# EAGLE schematic vulcan1 (EAGLE 7.1.0)
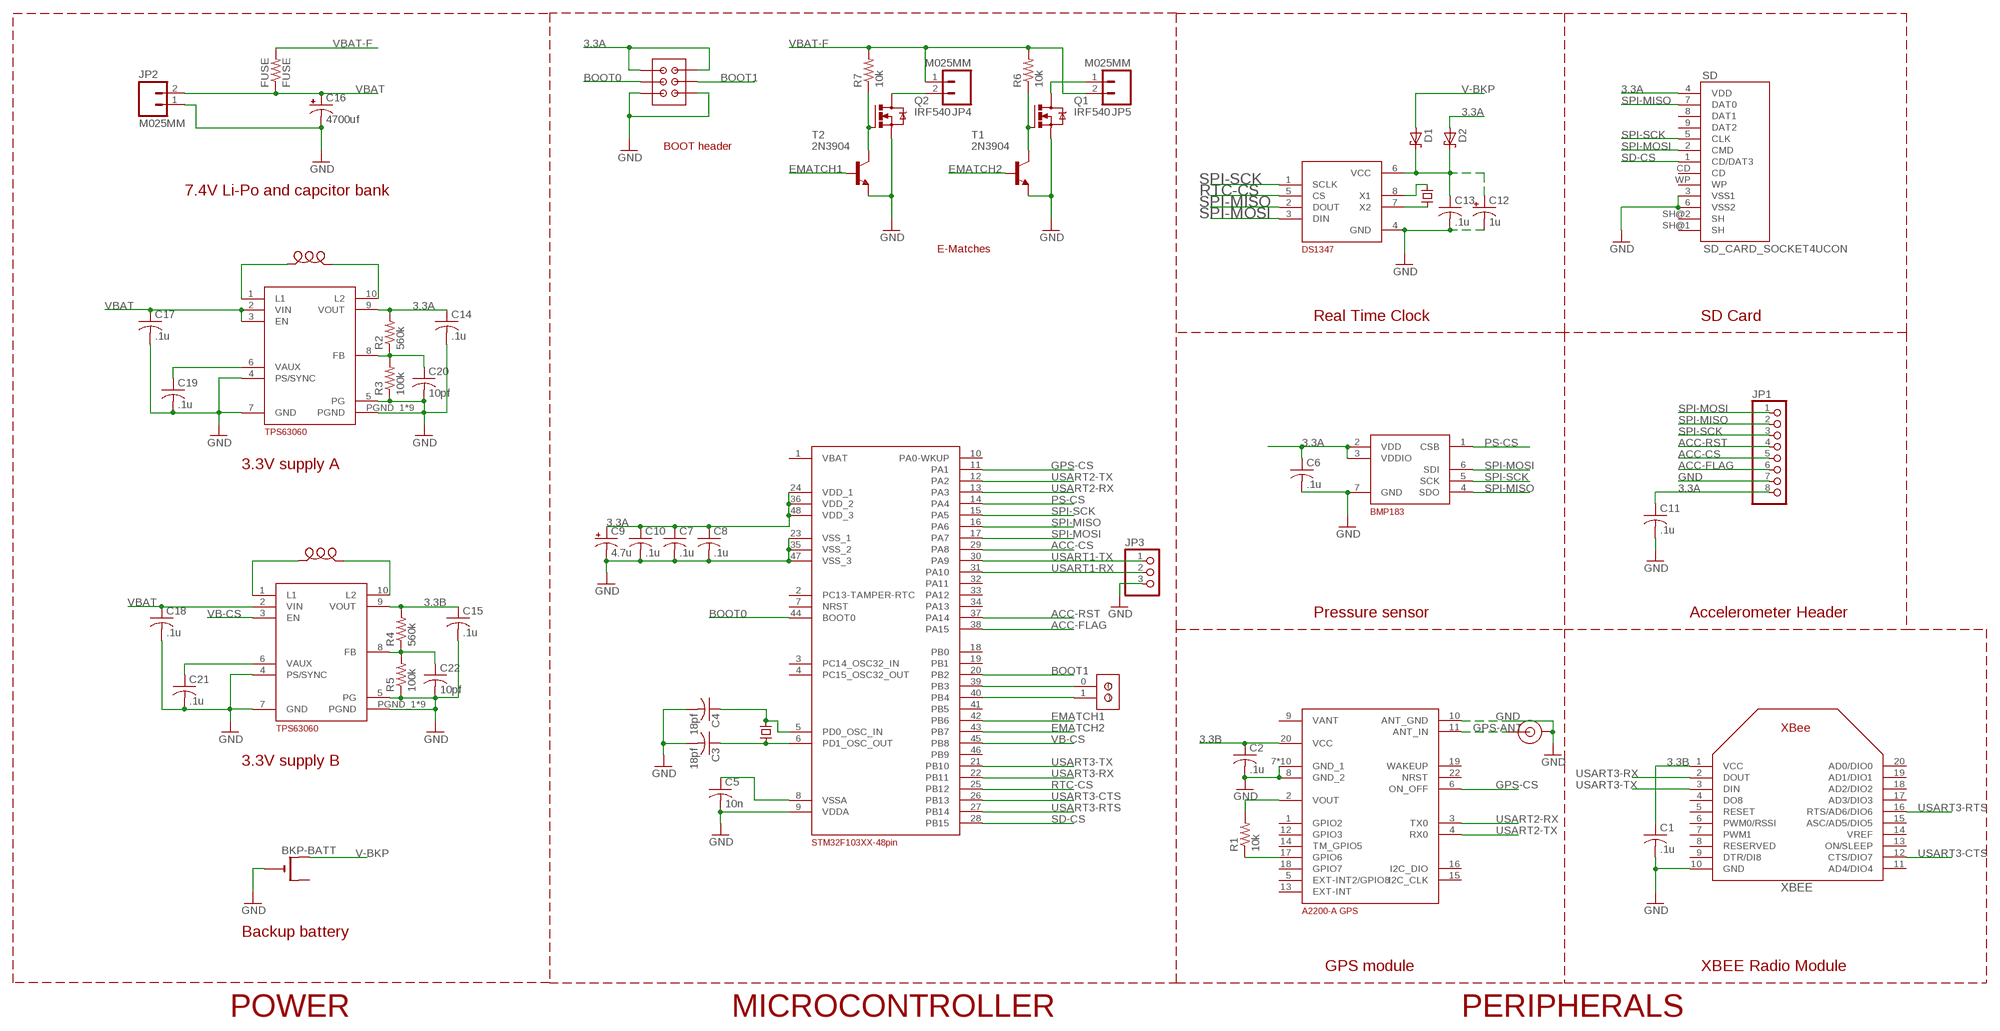
[diagram p0: schematic, sheet 1]

## Parts
A2200-A  A2200-A  [GPS-MODULE]
BKP-BATT  CR1220THM  [CR1220-THM]
BMP1  BMP183  [LGA-7]
C1  .1u  C-US025-030X050  [C025-030X050]
C2  .1u  C-US025-030X050  [C025-030X050]
C3  18pf  C-US025-030X050  [C025-030X050]
C4  18pf  C-US025-030X050  [C025-030X050]
C5  10n  C-US025-030X050  [C025-030X050]
C6  .1u  C-US025-030X050  [C025-030X050]
C7  .1u  C-US025-030X050  [C025-030X050]
C8  .1u  C-US025-030X050  [C025-030X050]
C9  4.7u  CPOL-USE2,5-6E  [E2,5-6E]
C10  .1u  C-US025-030X050  [C025-030X050]
C11  .1u  C-US025-030X050  [C025-030X050]
C12  1u  CPOL-USE2,5-6E  [E2,5-6E]
C13  .1u  C-US025-030X050  [C025-030X050]
C14  .1u  C-US025-030X050  [C025-030X050]
C15  .1u  C-US025-030X050  [C025-030X050]
C16  4700uf  CPOL-USE5-13  [E5-13]
C17  .1u  C-US025-030X050  [C025-030X050]
C18  .1u  C-US025-030X050  [C025-030X050]
C19  .1u  C-US025-030X050  [C025-030X050]
C20  10pf  C-US025-030X050  [C025-030X050]
C21  .1u  C-US025-030X050  [C025-030X050]
C22  10pf  C-US025-030X050  [C025-030X050]
D1  SCHOTTKY-DIODEDO35-7  [DO35-7]
D2  SCHOTTKY-DIODEDO35-7  [DO35-7]
DS1  DS1347  [TDFN-T822-2]
FUSE  FUSE  R-US_0204/7  [0204/7]
JP1  PINHD-1X8CLEANBIG  [1X08-CLEANBIG]
JP2  M025MM  [SCREWTERMINAL-5MM-2]
JP3  PINHD-1X3CB  [1X03-CLEANBIG]
JP4  M025MM  [SCREWTERMINAL-5MM-2]
JP5  M025MM  [SCREWTERMINAL-5MM-2]
Q1  IRF540  [TO220BV]
Q2  IRF540  [TO220BV]
R1  10k  R-US_0204/7  [0204/7]
R2  560k  R-US_0204/7  [0204/7]
R3  100k  R-US_0204/7  [0204/7]
R4  560k  R-US_0204/7  [0204/7]
R5  100k  R-US_0204/7  [0204/7]
R6  10k  R-US_0204/7  [0204/7]
R7  10k  R-US_0204/7  [0204/7]
SD  SD_CARD_SOCKET4UCON  [SDCARD_4UCONN]
T1  2N3904  [TO92]
T2  2N3904  [TO92]
TPS63060-A  TPS63060  [PWSON-N10]
TPS63060-B  TPS63060  [PWSON-N10]
U$1  SMA  [SMA]
U$2  HC/49US(AT49)  [HC/49US]
U$3  STM32F103XX-48PIN  [LQFP48]
U$4  ECX-306X  [ECX-306X]
U$5  ASPI-0520LR  [L-0520LR]
U$6  ASPI-0520LR  [L-0520LR]
U$7  2X3  [2X3]
U$8  1X2HEADER  [1X2HEADER]
XBEE  XBEE  [XBEE]

## Nets
3.3A: BMP1.2(VDD) BMP1.3(VDDIO) C6.1 C7.1 C8.1 C9.+ C10.1 C11.1 C14.1 D2.A JP1.8 R2.2 SD.4(VDD) TPS63060-A.9(VOUT) U$3.24(VDD_1) U$3.36(VDD_2) U$3.48(VDD_3) U$7.1 U$7.2
3.3B: A2200-A.20(VCC) C1.1 C2.1 C15.1 R4.2 TPS63060-B.9(VOUT) XBEE.1(VCC)
ACC-CS: JP1.5 U$3.29(PA8)
ACC-FLAG: JP1.6 U$3.38(PA15)
ACC-RST: JP1.4 U$3.37(PA14)
BOOT0: U$3.44(BOOT0) U$7.3
BOOT1: U$3.20(PB2) U$7.4
EMATCH1: T2.2(B) U$3.42(PB6)
EMATCH2: T1.2(B) U$3.43(PB7)
GND: A2200-A.7(GND_1) A2200-A.8(GND_2) A2200-A.10(ANT_GND) A2200-A.P$1(GND_1) A2200-A.P$2(GND_1) A2200-A.P$3(GND_1) A2200-A.P$4(GND_1) A2200-A.P$5(GND_1) A2200-A.P$6(GND_1) A2200-A.P$7(GND_1) A2200-A.P$8(GND_1) A2200-A.P$9(GND_1) BKP-BATT.- BMP1.7(GND) C1.2 C2.2 C3.2 C4.2 C5.2 C6.2 C7.2 C8.2 C9.- C10.2 C11.2 C12.- C13.2 C14.2 C15.2 C16.- C17.2 C18.2 C19.2 C20.2 C21.2 C22.2 DS1.4(GND) JP1.7 JP2.1 JP3.3 Q1.S Q2.S R3.1 R5.1 SD.3(VSS1) SD.6(VSS2) T1.3(E) T2.3(E) TPS63060-A.4(PS/SYNC) TPS63060-A.5(PG) TPS63060-A.7(GND) TPS63060-A.PGND_1(PGND) TPS63060-A.PGND_2(PGND) TPS63060-A.PGND_3(PGND) TPS63060-A.PGND_4(PGND) TPS63060-A.PGND_5(PGND) TPS63060-A.PGND_6(PGND) TPS63060-A.PGND_7(PGND) TPS63060-A.PGND_8(PGND) TPS63060-A.PGND_9(PGND) TPS63060-B.4(PS/SYNC) TPS63060-B.5(PG) TPS63060-B.7(GND) TPS63060-B.PGND_1(PGND) TPS63060-B.PGND_2(PGND) TPS63060-B.PGND_3(PGND) TPS63060-B.PGND_4(PGND) TPS63060-B.PGND_5(PGND) TPS63060-B.PGND_6(PGND) TPS63060-B.PGND_7(PGND) TPS63060-B.PGND_8(PGND) TPS63060-B.PGND_9(PGND) U$1.1(OUT) U$1.2(OUT) U$3.9(VDDA) U$3.23(VSS_1) U$3.35(VSS_2) U$3.47(VSS_3) U$7.5 U$7.6 XBEE.10(GND)
GPS-ANT: A2200-A.11(ANT_IN) U$1.3(IN)
GPS-CS: A2200-A.6(ON_OFF) U$3.11(PA1)
N$1: Q2.G R7.1 T2.1(C)
N$2: C5.1 U$3.8(VSSA)
N$3: TPS63060-B.1(L1) U$6.P$1
N$4: TPS63060-B.10(L2) U$6.P$2
N$5: TPS63060-A.1(L1) U$5.P$1
N$6: TPS63060-A.10(L2) U$5.P$2
N$7: DS1.7(X2) U$4.1
N$8: DS1.8(X1) U$4.4
N$9: C3.1 U$2.1 U$3.6(PD1_OSC_OUT)
N$10: C4.1 U$2.2 U$3.5(PD0_OSC_IN)
N$11: C19.1 TPS63060-A.6(VAUX)
N$12: C12.+ C13.1 D1.C D2.C DS1.6(VCC)
N$13: JP4.2 Q2.D
N$14: C20.1 R2.1 R3.2 TPS63060-A.8(FB)
N$15: C22.1 R4.1 R5.2 TPS63060-B.8(FB)
N$16: Q1.G R6.1 T1.1(C)
N$17: JP5.1 Q1.D
N$18: C21.1 TPS63060-B.6(VAUX)
N$20: A2200-A.2(VOUT) R1.2
N$21: A2200-A.17(GPIO6) R1.1
N$22: U$3.39(PB3) U$8.0
N$23: U$3.40(PB4) U$8.1
PS-CS: BMP1.1(CSB) U$3.14(PA4)
RTC-CS: DS1.5(CS) U$3.25(PB12)
SD-CS: SD.1(CD/DAT3) U$3.28(PB15)
SPI-MISO: BMP1.4(SDO) DS1.2(DOUT) JP1.2 SD.7(DAT0) U$3.16(PA6)
SPI-MOSI: BMP1.6(SDI) DS1.3(DIN) JP1.1 SD.2(CMD) U$3.17(PA7)
SPI-SCK: BMP1.5(SCK) DS1.1(SCLK) JP1.3 SD.5(CLK) U$3.15(PA5)
USART1-RX: JP3.2 U$3.31(PA10)
USART1-TX: JP3.1 U$3.30(PA9)
USART2-RX: A2200-A.3(TX0) U$3.13(PA3)
USART2-TX: A2200-A.4(RX0) U$3.12(PA2)
USART3-CTS: U$3.26(PB13) XBEE.12(CTS/DIO7)
USART3-RTS: U$3.27(PB14) XBEE.16(RTS/AD6/DIO6)
USART3-RX: U$3.22(PB11) XBEE.2(DOUT)
USART3-TX: U$3.21(PB10) XBEE.3(DIN)
V-BKP: BKP-BATT.+1(+) D1.A
VB-CS: TPS63060-B.3(EN) U$3.45(PB8)
VBAT: C16.+ C17.1 C18.1 FUSE.1 JP2.2 TPS63060-A.2(VIN) TPS63060-A.3(EN) TPS63060-B.2(VIN)
VBAT-F: FUSE.2 JP4.1 JP5.2 R6.2 R7.2
Unconnected: A2200-A.1(GPIO2) A2200-A.5(EXT-INT2/GPIO8) A2200-A.9(VANT) A2200-A.12(GPIO3) A2200-A.13(EXT-INT) A2200-A.14(TM_GPIO5) A2200-A.15(I2C_CLK) A2200-A.16(I2C_DIO) A2200-A.18(GPIO7) A2200-A.19(WAKEUP) A2200-A.22(NRST) BKP-BATT.+2(+1) SD.8(DAT1) SD.9(DAT2) SD.CD SD.SH@1(SH) SD.SH@2(SH) SD.WP U$3.1(VBAT) U$3.2(PC13-TAMPER-RTC) U$3.3(PC14_OSC32_IN) U$3.4(PC15_OSC32_OUT) U$3.7(NRST) U$3.10(PA0-WKUP) U$3.18(PB0) U$3.19(PB1) U$3.32(PA11) U$3.33(PA12) U$3.34(PA13) U$3.41(PB5) U$3.46(PB9) XBEE.4(DO8) XBEE.5(RESET) XBEE.6(PWM0/RSSI) XBEE.7(PWM1) XBEE.8(RESERVED) XBEE.9(DTR/DI8) XBEE.11(AD4/DIO4) XBEE.13(ON/SLEEP) XBEE.14(VREF) XBEE.15(ASC/AD5/DIO5) XBEE.17(AD3/DIO3) XBEE.18(AD2/DIO2) XBEE.19(AD1/DIO1) XBEE.20(AD0/DIO0)

## Notes on the sheet
- BOOT header
- 7.4V Li-Po and capcitor bank
- E-Matches
- Real Time Clock | SD Card
- 3.3V supply A
- Pressure sensor | Accelerometer Header
- 3.3V supply B
- Backup battery
- GPS module | XBEE Radio Module
- POWER | MICROCONTROLLER | PERIPHERALS

## Library data of the parts
A2200-A = vulcan-1:A2200-A
BKP-BATT = adafruit:CR1220: CR1216/CR1220/CR1225 12mm 3V lithium coin cell Great for battery packup. Both SMT and THM holders. Note the THM package has the ground pads on both sides of the PCB so that the masks are the same - this reduces the cost
BMP1 = vulcan-1:BMP183
C1-C8 C10 C11 C13-C15 C17-C22 = adafruit:C-US: CAPACITOR, American symbol
C9 C12 C16 = adafruit:CPOL-US: POLARIZED CAPACITOR, American symbol
D1 D2 = adafruit:SCHOTTKY-DIODE: Schottky Diode
DS1 = vulcan-1:DS1347
FUSE R1-R7 = adafruit:R-US_: RESISTOR, American symbol
JP1 = adafruit:PINHD-1X8: PIN HEADER
JP2 JP4 JP5 = SparkFun-Connectors:M02: Standard 2-pin 0.1" header. Use with - straight break away headers ( PRT-00116) - right angle break away headers (PRT-00553) - swiss pins (PRT-00743) - machine pins (PRT-00117) - female headers (PRT-00115) Molex polarized connector foot print use with: PRT-08233 with associated crimp pins and housings. 2.54_SCREWTERM for use with PRT-10571. 3.5mm Screw Terminal footprints for PRT-08084 5mm Screw Terminal footprints for use with PRT-08432; STOREFRONT_ID: PRT-08432
JP3 = adafruit:PINHD-1X3: PIN HEADER
Q1 Q2 = transistor-power:IRF540: HEXFET Power MOSFET
SD = SparkFun-Connectors:SD_CARD_SOCKET: SD Memory Card Connector, push-push normal type, CD enable, WP enable
T1 T2 = transistor:2N3904: NPN TRANSISTOR
TPS63060-A TPS63060-B = vulcan-1:TPS63060
U$1 = vulcan-1:SMA
U$2 = vulcan-1:HC/49US(AT49)
U$3 = vulcan-1:STM32F103XX-48PIN
U$4 = vulcan-1:ECX-306X
U$5 U$6 = vulcan-1:ASPI-0520LR
U$7 = vulcan-1:2X3
U$8 = 1x2 header:1X2HEADER
XBEE = adafruit:XBEE